# Altium schematic sheet USB.SchDoc
size A4; SheetNumber: 10; SheetTotal: 11
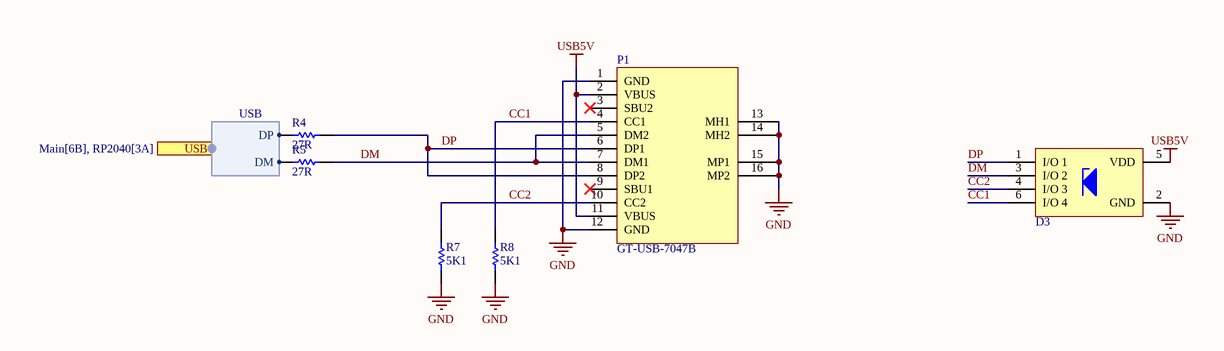
[diagram p0: USB.SchDoc]

## Parts
D3  3.3V  [WE-TVS_SOT23-6L]  (value not drawn)
P1  GT-USB-7047B  [GT-USB-7047B]
R4  27R  [RESC0603(1608)_N]
R5  27R  [RESC0603(1608)_N]
R7  5K1  [RESC0603(1608)_N]
R8  5K1  [RESC0603(1608)_N]

## Ports
USB (harness USB, see Main[6B], RP2040[3A])

## Harnesses
USB: DP, DM

## Nets
GND: D3.2(GND) P1.1(GND) P1.12(GND) P1.13(MH1) P1.14(MH2) P1.15(MP1) P1.16(MP2) R7.1 R8.1
USB5V: D3.5(VDD) P1.2(VBUS) P1.11(VBUS)
CC1: D3.6(I/O_4) P1.4(CC1) R8.2
CC2: D3.4(I/O_3) P1.10(CC2) R7.2
DM: D3.3(I/O_2) P1.5(DM2) P1.7(DM1) R5.2
DP: D3.1(I/O_1) P1.6(DP1) P1.8(DP2) R4.2
NetR4_1: R4.1 ; port USB.DP
NetR5_1: R5.1 ; port USB.DM

Not connected (* = marked no-connect by the designer): P1 3(SBU2)* 9(SBU1)*

## Library data of the parts
D3 = 824015043: WE-TVS TVS Diode – High Speed Series, SOT23-6L, 4+1 Channel, 3.3V, 2pF; Manufacturer: Wurth Elektronik; Channel ESD Clamping Voltage: 7.5V; Channel Reverse Leakage Current: 1µA; ESD Air Discharge Capability: 30kV; Polarity: Unidirectional; (Reverse) Breakdown Voltage: 4.5V; (Reverse) Peak Pulse Current: 30A; ComponentLink1Description: Website Link; ComponentLink1URL: https://www.we-online.com/redexpert/article/824015043?ad; ComponentLink2Description: Datasheet Link; ComponentLink2URL: https://www.we-online.com/redexpert/spec/824015043?ad; Manufacturer Part Number: 824015043; Category: ESD Protection; Match Code: WE-TVS; Mount: Surface Mount; Operating Temperature Max: 125°C; Operating Temperature Min: -55°C; Packaging: Tape and Reel; Case/Size Code: SOT23-6L; Length: 2.9mm; Width: 2.8mm; Height: 1.45mm; Channel Input Capacitance: 2pF; Channel Operating Voltage: 3.3V; ESD Contact Discharge Capability: 30kV; Number of Channels: 4+1
R4 R5 = Res 27R: Chipwiderstand, Oberflächenmontage, Dickschicht, 27 ohm, 50 V, 0603 [Metrisch 1608], 100 mW, ± 1%; Manufacturer: Multicomp; PackageReference: 0603; Value: 27R; OC_FARNELL: 2447316
R7 R8 = Res 5K6: Chipwiderstand, SMD, Baureihe MC, 5%; Manufacturer: Multicomp; Value: 5K6; PackageReference: 0603; OC_FARNELL: 9332219